# EAGLE design coax_mixer (EAGLE 5.09)
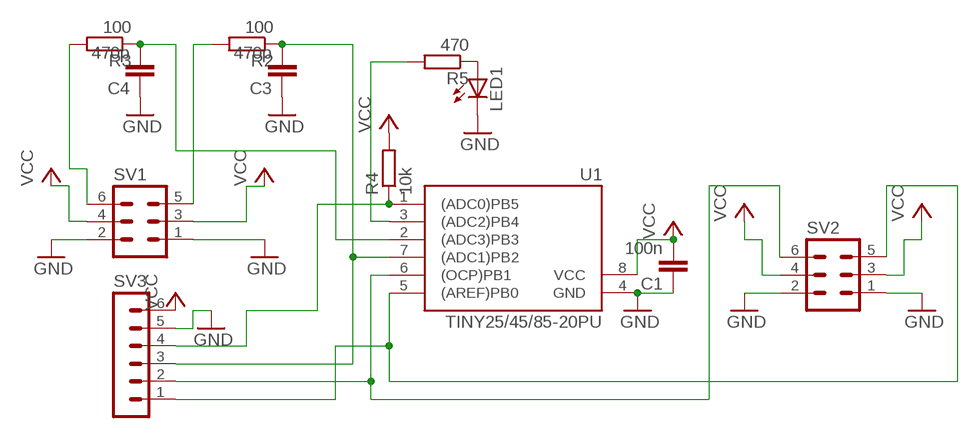
[diagram p0: schematic, sheet 1]

## Parts
C1  100n  C-EUC0805K  [C0805K]
C3  470p  C-EUC0805K  [C0805K]
C4  470p  C-EUC0805K  [C0805K]
LED1  LED5MM  [LED5MM]
R2  100  R-EU_R0805  [R0805]
R3  100  R-EU_R0805  [R0805]
R4  10k  R-EU_R0805  [R0805]
R5  470  R-EU_R0805  [R0805]
SV1  MA03-2  [MA03-2]
SV2  MA03-2  [MA03-2]
SV3  MA06-1  [MA06-1]
U1  TINY25/45/85-20PU  [DIL08]

## Nets
GND [power]: C1.1 C3.1 C4.1 LED1.K(C) SV1.1 SV1.2 SV2.1 SV2.2 SV3.5 U1.4(GND)
N$1: LED1.A R5.1
N$2: SV2.5 SV3.1 U1.5((AREF)PB0)
N$3: R3.2 SV1.6
N$4: SV2.6 SV3.2 U1.6((OCP)PB1)
N$5: R4.1 SV3.4 U1.1((ADC0)PB5)
N$6: R2.2 SV1.5
N$8: C4.2 R3.1 U1.2((ADC3)PB3)
N$10: C3.2 R2.1 SV3.3 U1.7((ADC1)PB2)
N$11: R5.2 U1.3((ADC2)PB4)
VCC [power]: C1.2 R4.2 SV1.3 SV1.4 SV2.3 SV2.4 SV3.6 U1.8(VCC)

## Library data of the parts
C1 C3 C4 = resistor:C-EU: CAPACITOR, European symbol
LED1 = led:LED: LED OSRAM: - CHIPLED LG R971, LG N971, LY N971, LG Q971, LY Q971, LO R971, LY R971 LH N974, LH R974 LS Q976, LO Q976, LY Q976 LO Q996 - Hyper CHIPLED LW Q18S LB Q993, LB Q99A, LB R99A - SideLED LS A670, LO A670, LY A670, LG A670, LP A670 LB A673, LV A673, LT A673, LW A673 LH A674 LY A675 LS A676, LA A676, LO A676, LY A676, LW A676 LS A679, LY A679, LG A679 - Hyper Micro SIDELED® LS Y876, LA Y876, LO Y876, LY Y876 LT Y87S - SmartLED LW L88C, LW L88S LB L89C, LB L89S, LG L890 LS L89K, LO L89K, LY L89K LS L896, LA L896, LO L896, LY L896 - TOPLED LS T670, LO T670, LY T670, LG T670, LP T670 LSG T670, LSP T670, LSY T670, LOP T670, LYG T670 LG T671, LOG T671, LSG T671 LB T673, LV T673, LT T673, LW T673 LH T674 LS T676, LA T676, LO T676, LY T676, LB T676, LH T676, LSB T676, LW T676 LB T67C, LV T67C, LT T67C, LS T67K, LO T67K, LY T67K, LW E67C LS E67B, LA E67B, LO E67B, LY E67B, LB E67C, LV E67C, LT E67C LW T67C LS T679, LY T679, LG T679 LS T770, LO T770, LY T770, LG T770, LP T770 LB T773, LV T773, LT T773, LW T773 LH T774 LS E675, LA E675, LY E675, LS T675 LS T776, LA T776, LO T776, LY T776, LB T776 LHGB T686 LT T68C, LB T68C - Hyper Mini TOPLED® LB M676 - Mini TOPLED Santana® LG M470 LS M47K, LO M47K, LY M47K Source: http://www.osram.convergy.de LUXEON: - LUMILED® LXK2-PW12-R00, LXK2-PW12-S00, LXK2-PW14-U00, LXK2-PW14-V00 LXK2-PM12-R00, LXK2-PM12-S00, LXK2-PM14-U00 LXK2-PE12-Q00, LXK2-PE12-R00, LXK2-PE12-S00, LXK2-PE14-T00, LXK2-PE14-U00 LXK2-PB12-K00, LXK2-PB12-L00, LXK2-PB12-M00, LXK2-PB14-N00, LXK2-PB14-P00, LXK2-PB14-Q00 LXK2-PR12-L00, LXK2-PR12-M00, LXK2-PR14-Q00, LXK2-PR14-R00 LXK2-PD12-Q00, LXK2-PD12-R00, LXK2-PD12-S00 LXK2-PH12-R00, LXK2-PH12-S00 LXK2-PL12-P00, LXK2-PL12-Q00, LXK2-PL12-R00 Source: www.luxeon.com KINGBRIGHT: KA-3528ASYC Source: www.kingbright.com
R2-R5 = resistor:R-EU_: RESISTOR, European symbol
SV1 SV2 = con-lstb:MA03-2: PIN HEADER
SV3 = con-lstb:MA06-1: PIN HEADER
U1 = avr-6:TINY25/45/85

## Net classes
0 default: width 0.406 mm, drill 0.5 mm
1 power: width 0.61 mm, drill 0.5 mm

## Board
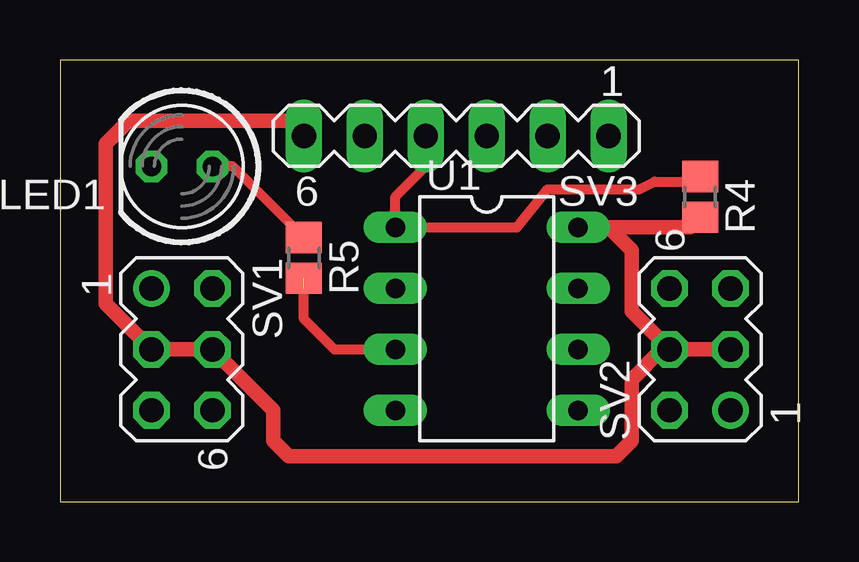
[diagram p1: board, top side]
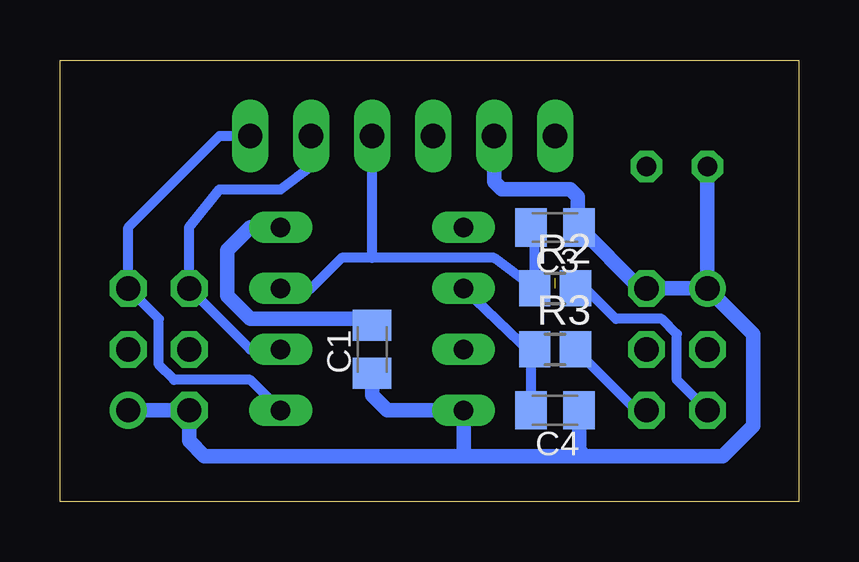
[diagram p2: board, bottom side, seen from below]

Size 30.79 x 18.41 mm. Coordinates in mm from the lower left corner, seen from the top.
Outline: 0,0 30.79,0 30.79,18.41 0,18.41 0,0
Copper layers (1*16): Top 0.035mm / dielectric 1.5mm / Bottom 0.035mm
Design rules "default": minimum track width 10mil, minimum drill 24mil, track to track 8mil, track to pad 8mil, pad to pad 8mil, via to via 8mil, smd to smd 8mil, copper to edge 40mil, drill to drill 8mil, minimum pad ring 10mil, minimum via ring 8mil, stop-mask expansion 4mil, vias tented up to drill 0mil, thermal gap 10mil

### Footprints (pad centres in the part's own frame; a part is rotated, then mirrored left to right if it is on the bottom)
C0805K = smd 1.3 x 1.6: 1 -1,0; 2 1,0
LED5MM = drill 0.813 octagon: A -1.27,0; K 1.27,0
R0805 = smd 1.3 x 1.5: 1 -0.85,0; 2 0.85,0
MA03-2 = drill 1.016 round: 1 -2.54,-1.27 | drill 1.016 octagon: 2 -2.54,1.27; 3 0,-1.27; 4 0,1.27; 5 2.54,-1.27; 6 2.54,1.27
MA06-1 = drill 1.016 long: 1 -6.35,0; 2 -3.81,0; 3 -1.27,0; 4 1.27,0; 5 3.81,0; 6 6.35,0
DIL08 = drill 0.813 long: 1 -3.81,-3.81; 2 -1.27,-3.81; 3 1.27,-3.81; 4 3.81,-3.81; 5 3.81,3.81; 6 1.27,3.81; 7 -1.27,3.81; 8 -3.81,3.81

### Placement (x,y rotation side)
C1  17.78,6.35 90 bottom
C3  10.16,11.43 180 bottom
C4  10.16,3.81 180 bottom
LED1  5.08,13.97 180 top
R2  10.16,8.89 0 bottom
R3  10.16,6.35 0 bottom
R4  26.67,12.7 270 top
R5  10.16,10.16 270 top
SV1  5.08,6.35 270 top
SV2  26.67,6.35 90 top
SV3  16.51,15.24 180 top
U1  17.78,7.62 270 top

### Tracks (layer width: path | path; a pad name or v marks a point on that pad's centre or on a via)
GND
  Bottom 0.61: SV1.1 LED1.K | SV1.1 SV1.2 6.62,8.89 C3.1 9.21,11.48 9.21,12.7 9.53,13.02 12.38,13.02 12.7,13.33 SV3.5 | SV1.1 1.91,6.98 1.91,3.17 3.17,1.91 8.89,1.91 | SV2.1 SV2.2 25.4,2.54 24.77,1.91 13.97,1.91 | 8.89,1.91 13.97,1.91 | C4.1 9.16,2.17 8.89,1.91 | 13.97,1.91 U1.4 17.14,3.81 17.78,4.45 C1.1
N$1
  Top 0.406: LED1.A 7.2,13.97 R5.1
N$2
  Bottom 0.406: U1.5 22.86,5.08 26.04,5.08 26.67,5.71 26.67,7.62 SV2.5 27.94,11.43 24.13,15.24 SV3.1
N$3
  Bottom 0.406: SV1.6 6.77,3.81 R3.2
N$4
  Bottom 0.406: U1.6 22.86,6.35 SV2.6 25.4,11.43 24.13,13.02 21.59,13.02 20.32,13.97 SV3.2
N$5
  Top 0.406: R4.1 26.45,13.33 24.77,13.33 24.13,13.02 20.32,13.02 19.05,11.43 U1.1 13.97,12.7 15.24,13.97 SV3.4
N$6
  Bottom 0.406: SV1.5 5.08,5.08 5.08,6.98 5.71,7.62 7.62,7.62 8.89,8.89 R2.2
N$8
  Bottom 0.406: C4.2 11.16,6.2 | 11.16,6.2 R3.1 | 11.16,6.2 U1.2
N$10
  Bottom 0.406: C3.2 11.01,11.28 R2.1 12.7,10.16 17.78,10.16 | U1.7 20.32,8.89 19.05,10.16 17.78,10.16 | 17.78,10.16 SV3.3
N$11  (1 unrouted)
  Top 0.406: 10.16,8.89 10.16,7.62 11.43,6.35 U1.3
VCC
  Top 0.61: SV2.4 SV2.3 | 22.86,11.43 U1.8 | 22.86,11.43 26.25,11.43 R4.2 | SV2.4 23.81,7.94 23.81,10.48 22.86,11.43 | SV2.4 25.08,6.35 23.81,5.08 23.81,2.54 23.18,1.91 9.53,1.91 8.89,2.54 8.89,3.81 SV1.4 SV1.3 1.91,8.26 1.91,14.92 2.86,15.88 9.53,15.88 SV3.6
  Bottom 0.61: C1.2 18.05,7.62 22.86,7.62 23.81,8.57 23.81,10.48 22.86,11.43 U1.8